# Altium schematic sheet COVER.SchDoc
size A2; SheetNumber: 1; SheetTotal: 17
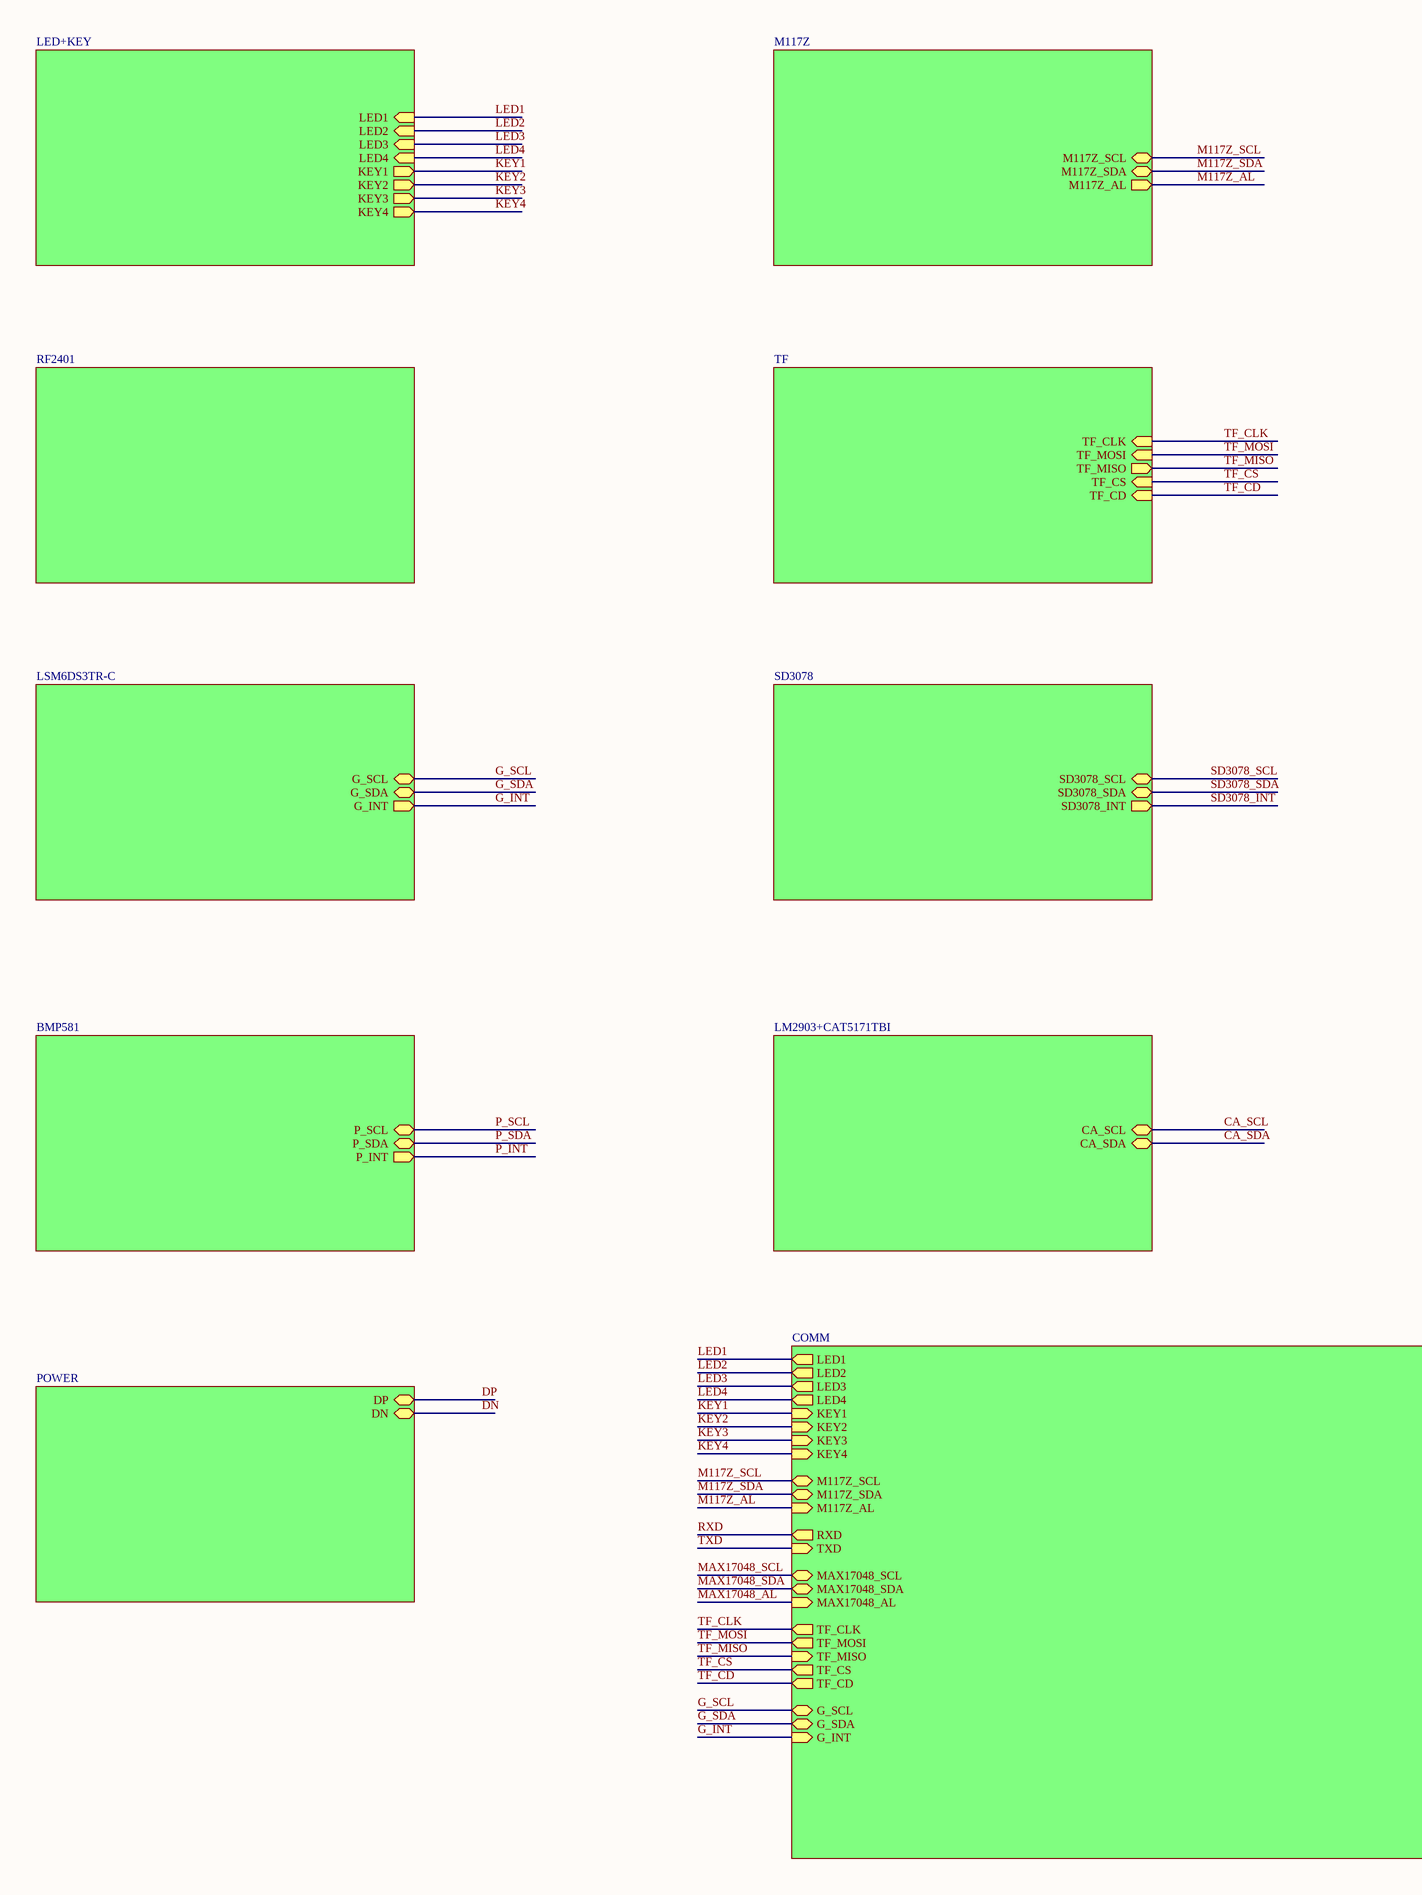
[diagram p0: COVER.SchDoc, left]
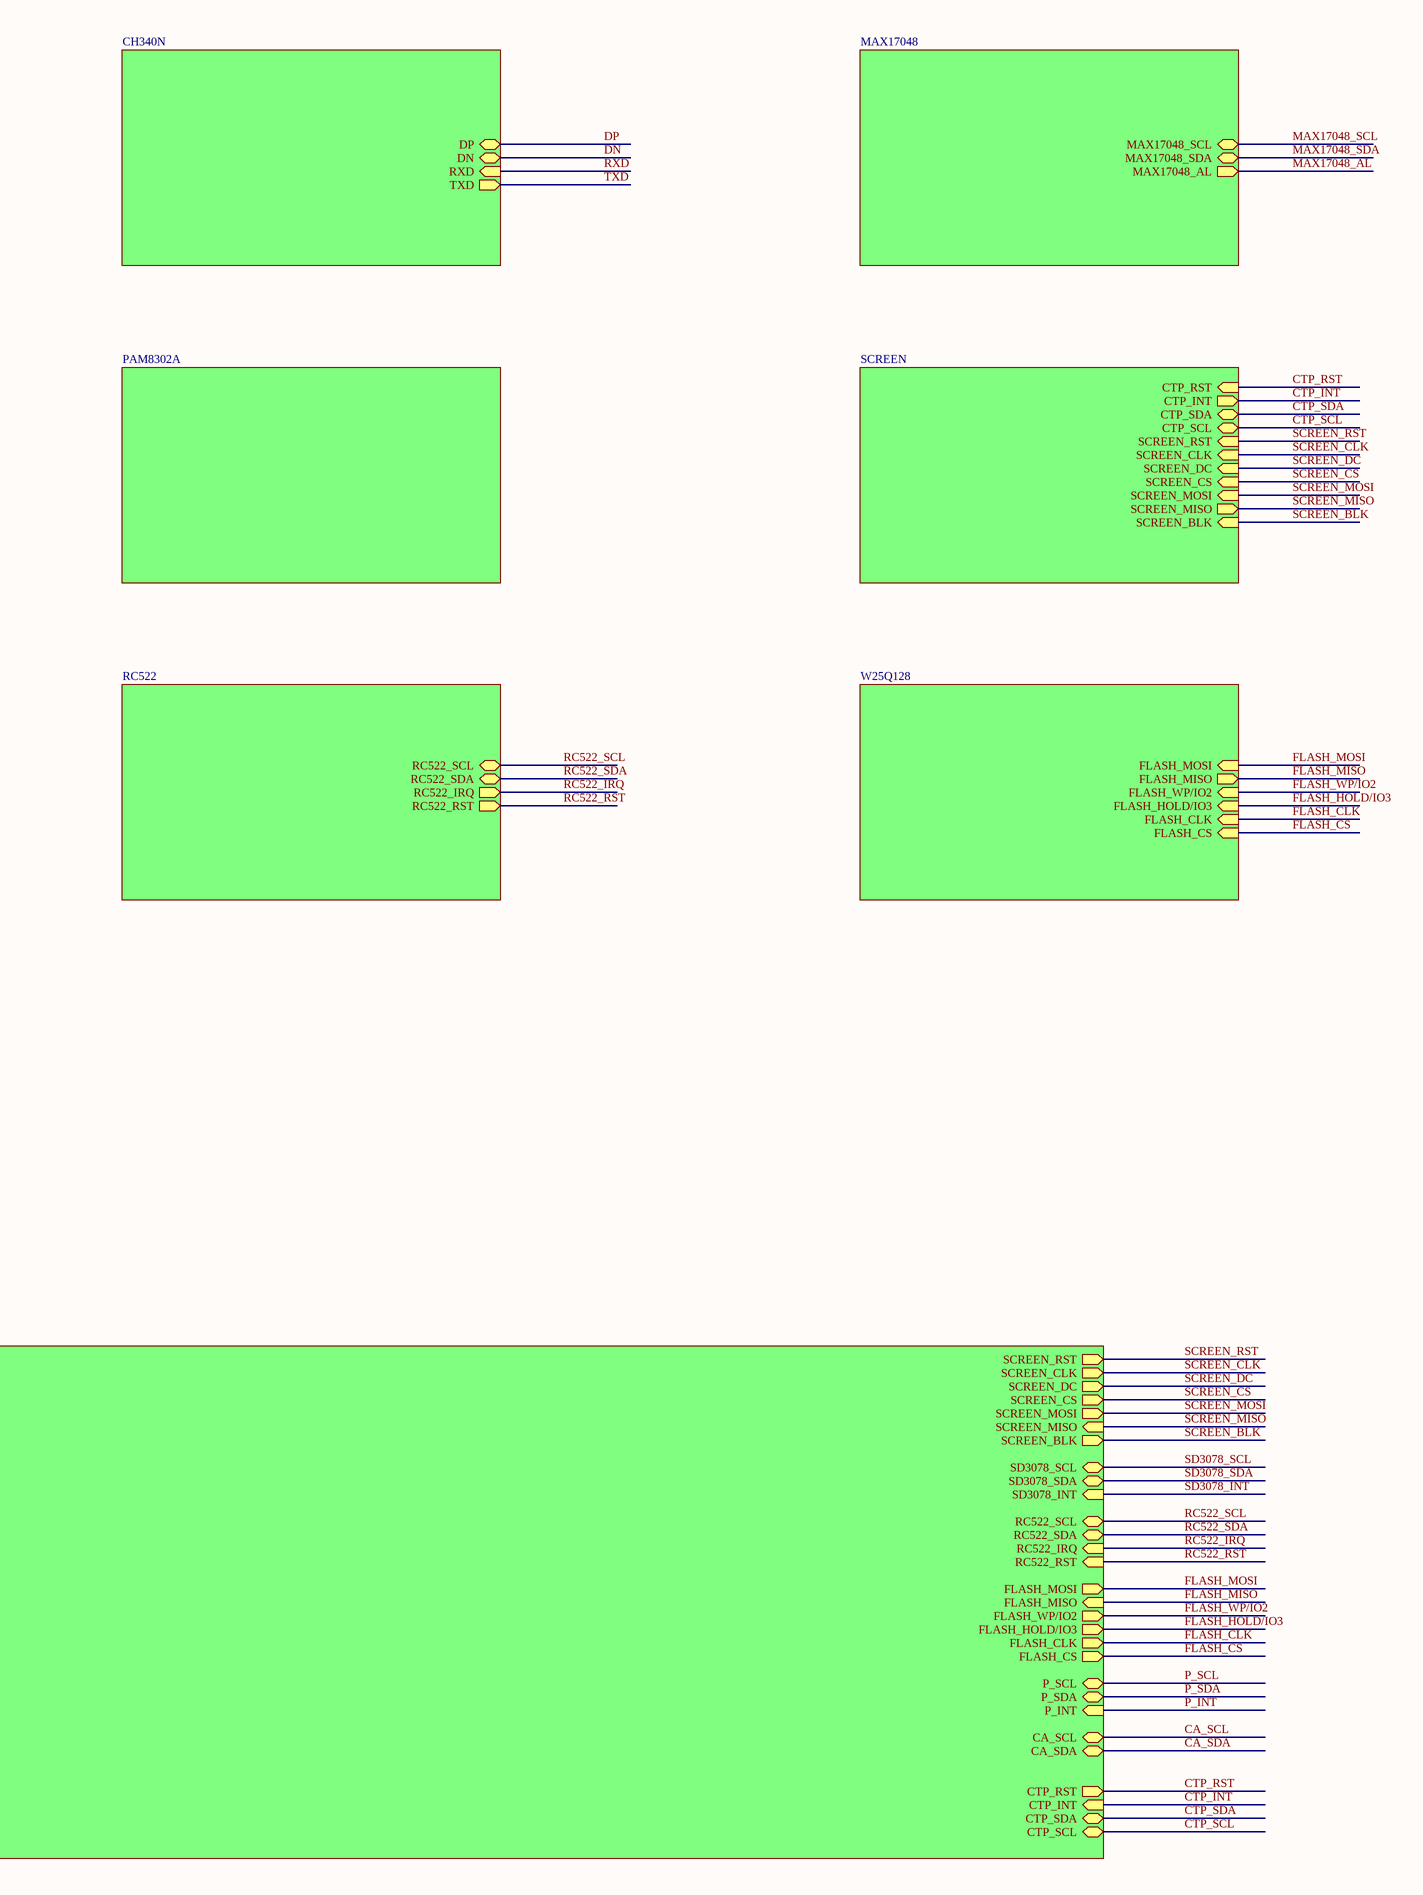
[diagram p1: COVER.SchDoc, right]

## Sub-sheets
BMP581 = BMP581: P_SCL (bidir), P_SDA (bidir), P_INT (out)
CH340N = CH340N: DP (bidir), DN (bidir), RXD (in), TXD (out)
COMM = COMM: LED1 (out), LED2 (out), LED3 (out), LED4 (out), KEY1 (in), KEY2 (in), KEY3 (in), KEY4 (in), M117Z_SCL (bidir), M117Z_SDA (bidir), M117Z_AL (in), RXD (out), TXD (in), MAX17048_SCL (bidir), MAX17048_SDA (bidir), MAX17048_AL (in), TF_CLK (out), TF_MOSI (out), TF_MISO (in), TF_CS (out), TF_CD (out), SCREEN_RST (out), SCREEN_CLK (out), SCREEN_DC (out), SCREEN_CS (out), SCREEN_MOSI (out), SCREEN_MISO (in), SCREEN_BLK (out), G_SCL (bidir), G_SDA (bidir), G_INT (in), SD3078_SCL (bidir), SD3078_SDA (bidir), SD3078_INT (in), RC522_SCL (bidir), RC522_SDA (bidir), RC522_IRQ (in), RC522_RST (in), FLASH_MOSI (out), FLASH_MISO (in), FLASH_WP/IO2 (out), FLASH_HOLD/IO3 (out), FLASH_CLK (out), FLASH_CS (out), P_SCL (bidir), P_SDA (bidir), P_INT (in), CA_SCL (bidir), CA_SDA (bidir), CTP_RST (out), CTP_INT (in), CTP_SDA (bidir), CTP_SCL (bidir)
LED+KEY = LED+KEY: LED1 (in), LED2 (in), LED3 (in), LED4 (in), KEY1 (out), KEY2 (out), KEY3 (out), KEY4 (out)
LM2903+CAT5171TBI = LM2903+CAT5171TBI: CA_SCL (bidir), CA_SDA (bidir)
LSM6DS3TR-C = LSM6DS3TR-C: G_SCL (bidir), G_SDA (bidir), G_INT (out)
M117Z = M117Z: M117Z_SCL (bidir), M117Z_SDA (bidir), M117Z_AL (out)
MAX17048 = MAX17048: MAX17048_SCL (bidir), MAX17048_SDA (bidir), MAX17048_AL (out)
PAM8302A = PAM8302A: no entries
POWER = POWER: DP (bidir), DN (bidir)
RC522 = RC522: RC522_SCL (bidir), RC522_SDA (bidir), RC522_IRQ (out), RC522_RST (out)
RF2401 = RF2401: no entries
SCREEN = SCREEN: SCREEN_RST (in), SCREEN_CLK (in), SCREEN_DC (in), SCREEN_CS (in), SCREEN_MOSI (in), SCREEN_MISO (out), SCREEN_BLK (in), CTP_RST (in), CTP_INT (out), CTP_SDA (bidir), CTP_SCL (bidir)
SD3078 = SD3078: SD3078_SCL (bidir), SD3078_SDA (bidir), SD3078_INT (out)
TF = TF: TF_CLK (in), TF_MOSI (in), TF_MISO (out), TF_CS (in), TF_CD (in)
W25Q128 = W25Q128: FLASH_MOSI (in), FLASH_MISO (out), FLASH_WP/IO2 (in), FLASH_HOLD/IO3 (in), FLASH_CLK (in), FLASH_CS (in)

## Nets
CA_SCL: sheet COMM/CA_SCL, sheet LM2903+CAT5171TBI/CA_SCL
CA_SDA: sheet COMM/CA_SDA, sheet LM2903+CAT5171TBI/CA_SDA
CTP_INT: sheet SCREEN/CTP_INT, sheet COMM/CTP_INT
CTP_RST: sheet SCREEN/CTP_RST, sheet COMM/CTP_RST
CTP_SCL: sheet SCREEN/CTP_SCL, sheet COMM/CTP_SCL
CTP_SDA: sheet SCREEN/CTP_SDA, sheet COMM/CTP_SDA
DN: sheet CH340N/DN, sheet POWER/DN
DP: sheet CH340N/DP, sheet POWER/DP
FLASH_CLK: sheet W25Q128/FLASH_CLK, sheet COMM/FLASH_CLK
FLASH_CS: sheet W25Q128/FLASH_CS, sheet COMM/FLASH_CS
FLASH_HOLD/IO3: sheet W25Q128/FLASH_HOLD/IO3, sheet COMM/FLASH_HOLD/IO3
FLASH_MISO: sheet W25Q128/FLASH_MISO, sheet COMM/FLASH_MISO
FLASH_MOSI: sheet W25Q128/FLASH_MOSI, sheet COMM/FLASH_MOSI
FLASH_WP/IO2: sheet W25Q128/FLASH_WP/IO2, sheet COMM/FLASH_WP/IO2
G_INT: sheet LSM6DS3TR-C/G_INT, sheet COMM/G_INT
G_SCL: sheet LSM6DS3TR-C/G_SCL, sheet COMM/G_SCL
G_SDA: sheet LSM6DS3TR-C/G_SDA, sheet COMM/G_SDA
KEY1: sheet LED+KEY/KEY1, sheet COMM/KEY1
KEY2: sheet LED+KEY/KEY2, sheet COMM/KEY2
KEY3: sheet LED+KEY/KEY3, sheet COMM/KEY3
KEY4: sheet LED+KEY/KEY4, sheet COMM/KEY4
LED1: sheet LED+KEY/LED1, sheet COMM/LED1
LED2: sheet LED+KEY/LED2, sheet COMM/LED2
LED3: sheet LED+KEY/LED3, sheet COMM/LED3
LED4: sheet LED+KEY/LED4, sheet COMM/LED4
M117Z_AL: sheet M117Z/M117Z_AL, sheet COMM/M117Z_AL
M117Z_SCL: sheet M117Z/M117Z_SCL, sheet COMM/M117Z_SCL
M117Z_SDA: sheet M117Z/M117Z_SDA, sheet COMM/M117Z_SDA
MAX17048_AL: sheet MAX17048/MAX17048_AL, sheet COMM/MAX17048_AL
MAX17048_SCL: sheet MAX17048/MAX17048_SCL, sheet COMM/MAX17048_SCL
MAX17048_SDA: sheet MAX17048/MAX17048_SDA, sheet COMM/MAX17048_SDA
P_INT: sheet BMP581/P_INT, sheet COMM/P_INT
P_SCL: sheet BMP581/P_SCL, sheet COMM/P_SCL
P_SDA: sheet BMP581/P_SDA, sheet COMM/P_SDA
RC522_IRQ: sheet RC522/RC522_IRQ, sheet COMM/RC522_IRQ
RC522_RST: sheet RC522/RC522_RST, sheet COMM/RC522_RST
RC522_SCL: sheet RC522/RC522_SCL, sheet COMM/RC522_SCL
RC522_SDA: sheet RC522/RC522_SDA, sheet COMM/RC522_SDA
RXD: sheet CH340N/RXD, sheet COMM/RXD
SCREEN_BLK: sheet SCREEN/SCREEN_BLK, sheet COMM/SCREEN_BLK
SCREEN_CLK: sheet SCREEN/SCREEN_CLK, sheet COMM/SCREEN_CLK
SCREEN_CS: sheet SCREEN/SCREEN_CS, sheet COMM/SCREEN_CS
SCREEN_DC: sheet SCREEN/SCREEN_DC, sheet COMM/SCREEN_DC
SCREEN_MISO: sheet SCREEN/SCREEN_MISO, sheet COMM/SCREEN_MISO
SCREEN_MOSI: sheet SCREEN/SCREEN_MOSI, sheet COMM/SCREEN_MOSI
SCREEN_RST: sheet SCREEN/SCREEN_RST, sheet COMM/SCREEN_RST
SD3078_INT: sheet SD3078/SD3078_INT, sheet COMM/SD3078_INT
SD3078_SCL: sheet SD3078/SD3078_SCL, sheet COMM/SD3078_SCL
SD3078_SDA: sheet SD3078/SD3078_SDA, sheet COMM/SD3078_SDA
TF_CD: sheet TF/TF_CD, sheet COMM/TF_CD
TF_CLK: sheet TF/TF_CLK, sheet COMM/TF_CLK
TF_CS: sheet TF/TF_CS, sheet COMM/TF_CS
TF_MISO: sheet TF/TF_MISO, sheet COMM/TF_MISO
TF_MOSI: sheet TF/TF_MOSI, sheet COMM/TF_MOSI
TXD: sheet CH340N/TXD, sheet COMM/TXD